# Altium schematic sheet sensors_and_dpg_ports.SchDoc: Sensor Interfacing Components
size A4; DrawnBy: Quentin Boet; SheetNumber: 5; SheetTotal: 6
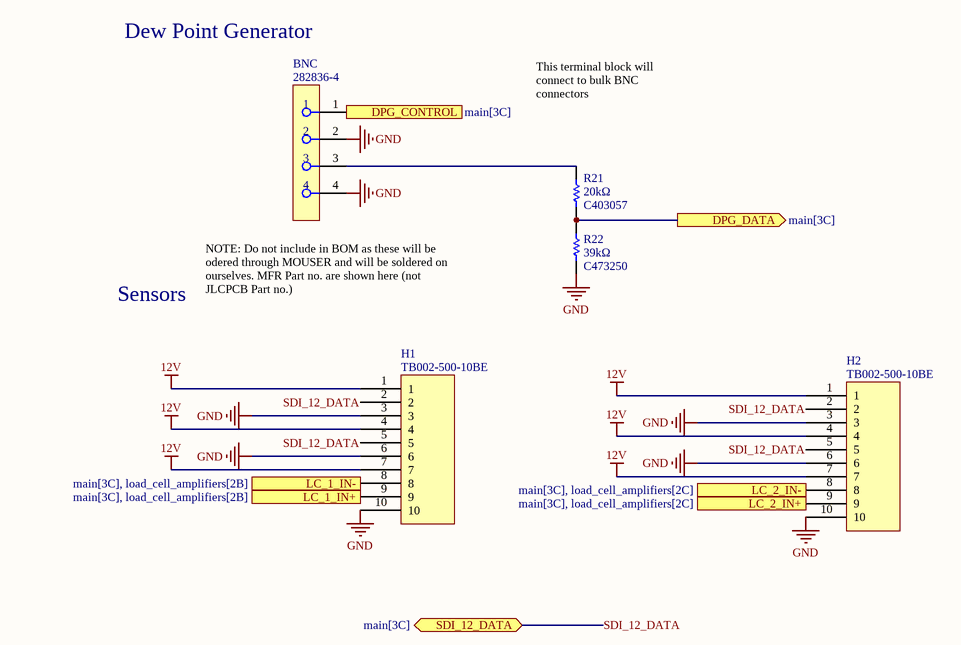
[diagram p0: sensors_and_dpg_ports.SchDoc]

## Parts
BNC  282836-4  [FP-282836-4-MFG]
H1  TB002-500-10BE  [TB002-500-10BE]
H2  TB002-500-10BE  [TB002-500-10BE]
R21  Resistance: 20kΩ  JLCPCB Part: C403057  [RESC1608X55X30ML15T15]  (hidden comment: ERJ-3EKF2002V)
R22  JLCPCB Part: C473250  Resistance: 39kΩ  [RESC1608X55X30LL20T20]  (hidden comment: ERA-3AEB393V)

## Ports
DPG_CONTROL (in, see main[3C]), DPG_DATA (out, see main[3C]), LC_1_IN+ (out, see main[3C], load_cell_amplifiers[2B]), LC_1_IN- (out, see main[3C], load_cell_amplifiers[2B]), LC_2_IN+ (out, see main[3C], load_cell_amplifiers[2C]), LC_2_IN- (out, see main[3C], load_cell_amplifiers[2C]), SDI_12_DATA (bidir, see main[3C])

## Nets
12V: H1.1 H1.4 H1.7 H2.1 H2.4 H2.7
GND: BNC.2 BNC.4 H1.3 H1.6 H1.10 H2.3 H2.6 H2.10 R22.1
DPG_CONTROL: BNC.1 ; port DPG_CONTROL
DPG_DATA: R21.1 R22.2 ; port DPG_DATA
LC_1_IN+: H1.9 ; port LC_1_IN+
LC_1_IN-: H1.8 ; port LC_1_IN-
LC_2_IN+: H2.9 ; port LC_2_IN+
LC_2_IN-: H2.8 ; port LC_2_IN-
SDI_12_DATA: H1.2 H1.5 H2.2 H2.5 ; port SDI_12_DATA
NetBNC_3: BNC.3 R21.2

## Notes on the sheet
- Dew Point Generator
- This terminal block will connect to bulk BNC connectors
- Sensors
- (near BNC) NOTE: Do not include in BOM as these will be odered through MOUSER and will be soldered on ourselves. MFR Part no. are shown here (not JLCPCB Part no.)
- Date:
- Sheet
- of
- Time:
- Revision:
- Drawn by:
- File:

## Library data of the parts
BNC = CMP-03790-46505329-1: 282836-4 Connector, Terminal Block; Wire Receptacle; 4 Pos.; 16-30 AWG; 0.197 in. CL; Sid; Manufacturer Lifecycle Status: ACTIVE; Number of Contacts: 4; Max Supply Voltage (AC): 300V; Wire Gauge (Min): 30AWG; Max Current Rating: 13.5A; Approvals: UL; Number of Levels: 1; Thread Size: M3; Connector System: Wire-to-Board; Voltage Rating (DC): 250V; Pitch: 5mm; Plating: Brass; Tail Length: 3.5mm; Housing Color: Green; Number of Rows: 1; REACH SVHC: Unknown; Lead Pitch: 5mm; Depth: 8.2mm; Lead Free: Lead Free; Mount: Through Hole; Contact Plating: Tin; Housing Material: Polyamide; ELV: Compliant; Radiation Hardening: No; RoHS: Compliant; Number of Circuits: 4; Voltage Rating: 300V; Contact Material: Brass; NexarPartId: 46505329; Current Rating: 13.5A; Max Voltage Rating (AC): 300V; Orientation: Straight; Number of Positions: 4; Lifecycle Status: Production; Operating Supply Voltage: 300V; Connector Type: Receptacle; Number of Positions Per Level: 4; Flammability Rating: UL94 V-0; Packaging: Bulk; Termination: Screw, Solder; Wire Gauge (Max): 30AWG; Number of Poles: 4; Width: 10mm; Voltage Rating (AC): 250V; Length: 20mm; Current: 13.5A; Voltage: 300V; Color: Green; JLCPCB Part: jlcpcb part no.
H1 H2 = TB002-500-10BE-1: 2~24 Poles, Screw Type, Horizontal, 5.0 Pitch, 22~12 (AWG), Terminal Block Connector; Number of Positions Per Level: 10; Plating: Steel; Pitch: 5mm; Min Operating Temperature: -40°C; Width: 7.6mm; Contact Plating: Tin; Orientation: Horizontal; Height: 10mm; Max Operating Temperature: 105°C; Mounting Technology: Through Hole; JLCPCB Part: jlcpcb part no.
R21 = CMP-2000-00318-1: Manufacturer: Panasonic; Part Number: ERJ-3EKF2002V
R22 = CMP-2000-00055-1: Manufacturer: Panasonic; Part Number: ERA-3AEB393V